# Altium schematic sheet ADC.SchDoc
size OrCAD E; SheetNumber: 1; SheetTotal: 1
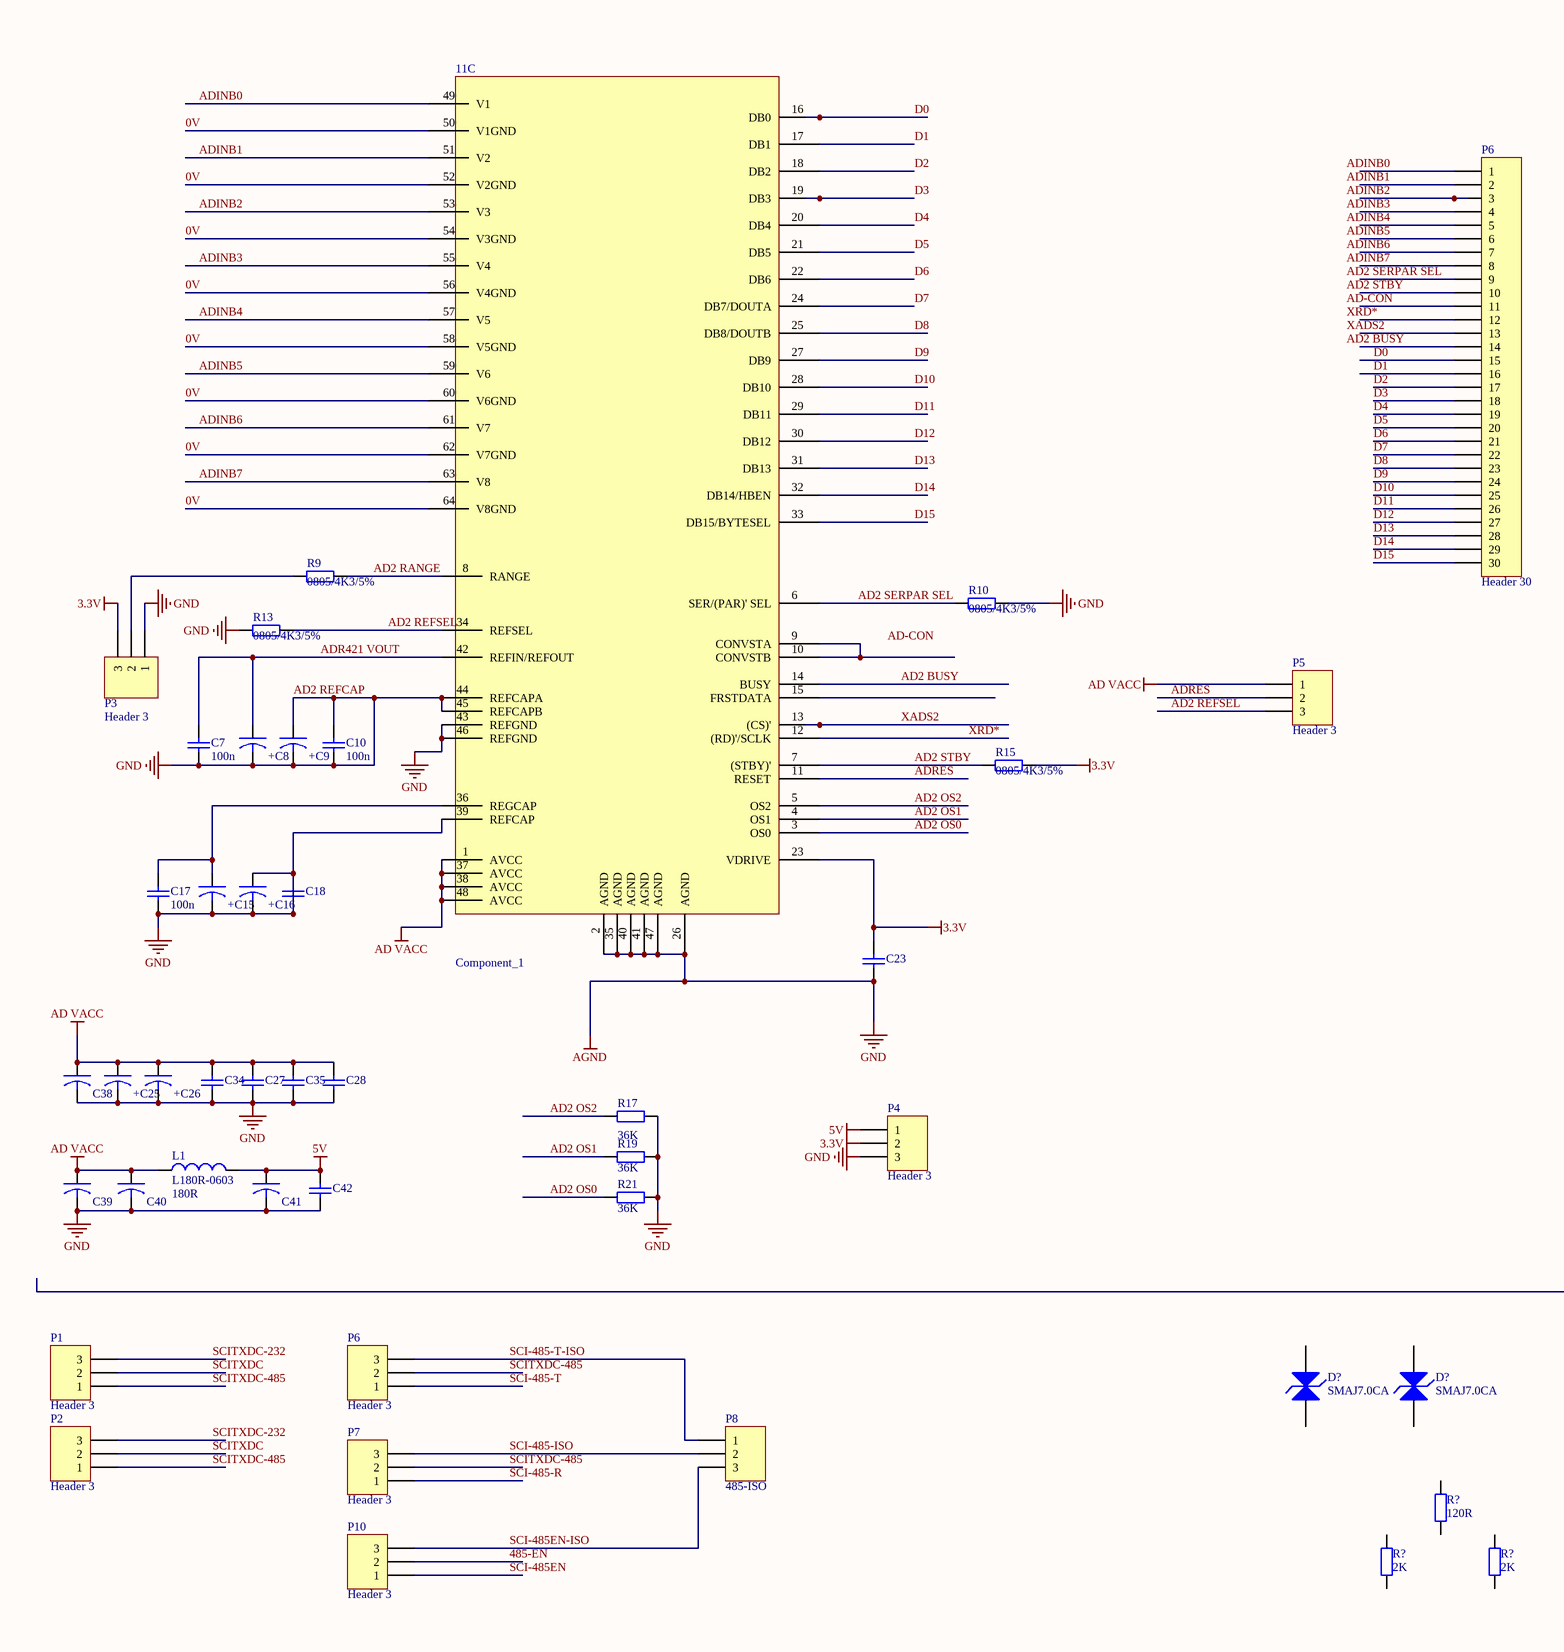
[diagram p0: ADC.SchDoc, left]
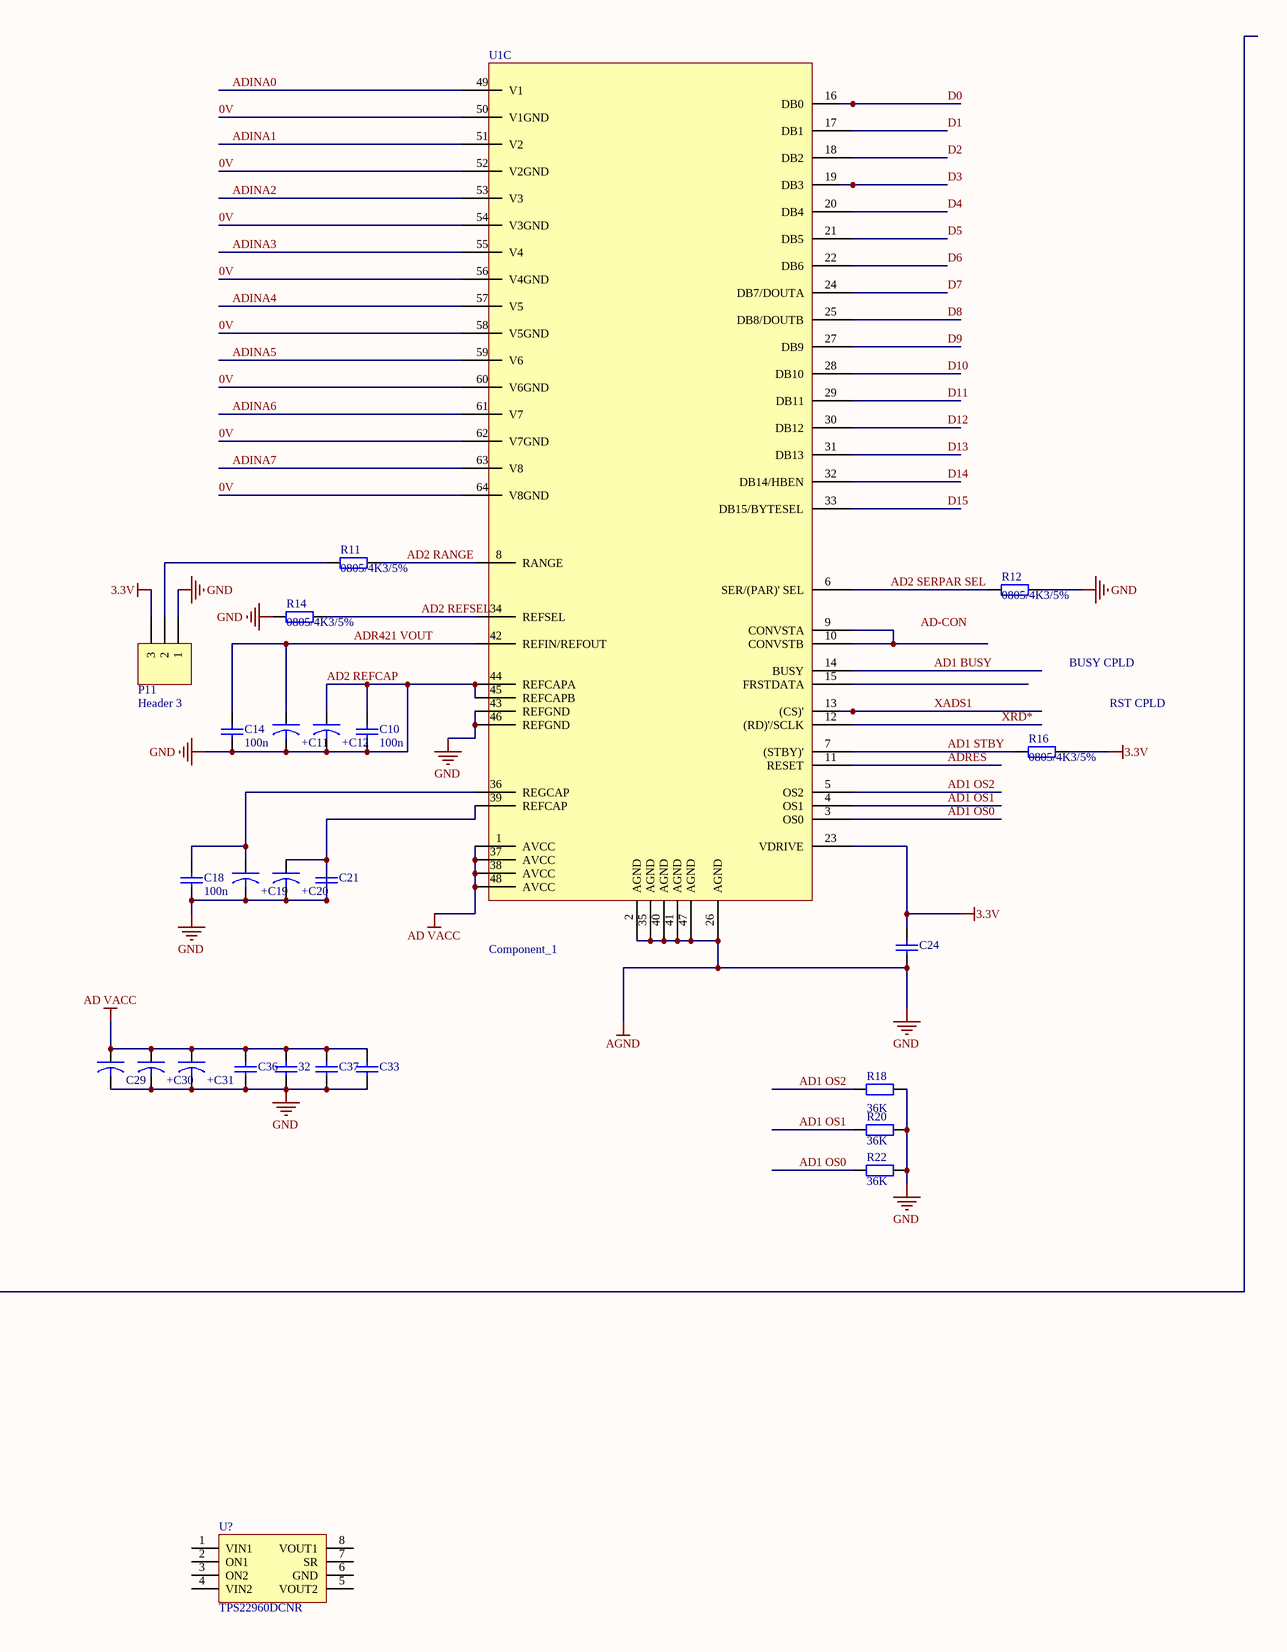
[diagram p1: ADC.SchDoc, right]

## Parts
(Parts that share a designator on the sheet are numbered #1, #2 ... from top to bottom, then left to right.)
11  Component_1  [LQFP-64_L10.0-W10.0-P0.50-LS12.0-BL]  (part C of 3)
32  C100n-1206  [C0805]  (value not drawn)
+C8  CD10u/25V-B(3528)  [C1206]  (value not drawn)
+C9  CD10u/25V-B(3528)  [C0805]  (value not drawn)
+C11  CD10u/25V-B(3528)  [C1206]  (value not drawn)
+C12  CD10u/25V-B(3528)  [C0805]  (value not drawn)
+C15  CD10u/25V-B(3528)  [C0805]  (value not drawn)
+C16  CD10u/25V-B(3528)  [C0805]  (value not drawn)
+C19  CD10u/25V-B(3528)  [C0805]  (value not drawn)
+C20  CD10u/25V-B(3528)  [C0805]  (value not drawn)
+C25  CD10u/25V-B(3528)  [C0805]  (value not drawn)
+C26  CD10u/25V-B(3528)  [C0805]  (value not drawn)
+C30  CD10u/25V-B(3528)  [C0805]  (value not drawn)
+C31  CD10u/25V-B(3528)  [C0805]  (value not drawn)
C7  value 100n  [C0805]  (hidden comment: C100n-1206)
C10#1  value 100n  [C0805]  (hidden comment: C100n-1206)
C10#2  value 100n  [C0805]  (hidden comment: C100n-1206)
C14  value 100n  [C0805]  (hidden comment: C100n-1206)
C17  value 100n  [C0805]  (hidden comment: C100n-1206)
C18#1  value 100n  [C0805]  (hidden comment: C100n-1206)
C18#2  C100n-1206  [C0805]  (value not drawn)
C21  C100n-1206  [C0805]  (value not drawn)
C23  C100n-1206  [C0805]  (value not drawn)
C24  C100n-1206  [C0805]  (value not drawn)
C27  C100n-1206  [C0805]  (value not drawn)
C28  C100n-1206  [C0805]  (value not drawn)
C29  CD10u/25V-B(3528)  [C0805]  (value not drawn)
C33  C100n-1206  [C0805]  (value not drawn)
C34  C100n-1206  [C0805]  (value not drawn)
C35  C100n-1206  [C0805]  (value not drawn)
C36  C100n-1206  [C0805]  (value not drawn)
C37  C100n-1206  [C0805]  (value not drawn)
C38  CD10u/25V-B(3528)  [C0805]  (value not drawn)
C39  CD10u/25V-B(3528)  [C0805]  (value not drawn)
C40  CD10u/25V-B(3528)  [C0805]  (value not drawn)
C41  CD10u/25V-B(3528)  [C0805]  (value not drawn)
C42  C100n-1206  [C0805]  (value not drawn)
D?#1  SMAJ7.0CA  [DO-214AC(SMA)]
D?#2  SMAJ7.0CA  [DO-214AC(SMA)]
L1  L180R-0603  value 180R  [R38]
P1  Header 3  [HDR1X3]
P2  Header 3  [HDR1X3]
P3  Header 3  [HDR1X3]
P4  Header 3  [HDR1X3]
P5  Header 3  [HDR1X3]
P6#1  Header 30  [HDR1X30]
P6#2  Header 3  [HDR1X3]
P7  Header 3  [HDR1X3]
P8  485-ISO  [HDR1X3]
P10  Header 3  [HDR1X3]
P11  Header 3  [HDR1X3]
R9  value 0805/4K3/5%  [AXIAL-0.4]  (hidden comment: R300R-0805)
R10  value 0805/4K3/5%  [AXIAL-0.4]  (hidden comment: R300R-0805)
R11  value 0805/4K3/5%  [AXIAL-0.4]  (hidden comment: R300R-0805)
R12  value 0805/4K3/5%  [AXIAL-0.4]  (hidden comment: R300R-0805)
R13  value 0805/4K3/5%  [AXIAL-0.4]  (hidden comment: R300R-0805)
R14  value 0805/4K3/5%  [AXIAL-0.4]  (hidden comment: R300R-0805)
R15  value 0805/4K3/5%  [AXIAL-0.4]  (hidden comment: R300R-0805)
R16  value 0805/4K3/5%  [AXIAL-0.4]  (hidden comment: R300R-0805)
R17  value 36K  [AXIAL-0.4]  (hidden comment: R36K-0805)
R18  value 36K  [AXIAL-0.4]  (hidden comment: R36K-0805)
R19  value 36K  [AXIAL-0.4]  (hidden comment: R36K-0805)
R20  value 36K  [AXIAL-0.4]  (hidden comment: R36K-0805)
R21  value 36K  [AXIAL-0.4]  (hidden comment: R36K-0805)
R22  value 36K  [AXIAL-0.4]  (hidden comment: R36K-0805)
R?#1  value 120R  [R1206L]  (hidden comment: R120R-1206)
R?#2  value 2K  [R0805L]  (hidden comment: R2K-0805)
R?#3  value 2K  [R0805L]  (hidden comment: R2K-0805)
U1  Component_1  [LQFP-64_L10.0-W10.0-P0.50-LS12.0-BL]  (part C of 3)
U?  TPS22960DCNR  [SOT23-8]

## Nets
3.3V: 11.23(VDRIVE) C23.2 C24.2 P3.3 P4.2 P11.3 R15.1 R16.1 U1.23(VDRIVE)
5V: C41.1 C42.2 L1.2 P4.1
AD2 REFCAP: 11.2(AGND) 11.26(AGND) 11.35(AGND) 11.39(REFCAP) 11.40(AGND) 11.41(AGND) 11.43(REFGND) 11.44(REFCAPA) 11.45(REFCAPB) 11.46(REFGND) 11.47(AGND) 32.1 +C8.2 +C9.1 +C9.2 +C11.2 +C12.1 +C12.2 +C15.2 +C16.1 +C16.2 +C19.2 +C20.1 +C20.2 +C25.2 +C26.2 +C30.2 +C31.2 C7.1 C10#1.1 C10#1.2 C10#2.1 C10#2.2 C14.1 C17.1 C18#1.1 C18#2.1 C18#2.2 C21.1 C21.2 C23.1 C24.1 C27.1 C28.1 C29.2 C33.1 C34.1 C35.1 C36.1 C37.1 C38.2 C39.2 C40.2 C41.2 C42.1 P3.1 P4.3 P11.1 R10.1 R12.1 R13.2 R14.2 R17.2 R18.2 R19.2 R20.2 R21.2 R22.2 U1.2(AGND) U1.26(AGND) U1.35(AGND) U1.39(REFCAP) U1.40(AGND) U1.41(AGND) U1.43(REFGND) U1.44(REFCAPA) U1.45(REFCAPB) U1.46(REFGND) U1.47(AGND)  [also labelled AGND, GND]
AD VACC: 11.1(AVCC) 11.37(AVCC) 11.38(AVCC) 11.48(AVCC) 32.2 +C25.1 +C26.1 +C30.1 +C31.1 C27.2 C28.2 C29.1 C33.2 C34.2 C35.2 C36.2 C37.2 C38.1 C39.1 C40.1 L1.1 P5.1 U1.1(AVCC) U1.37(AVCC) U1.38(AVCC) U1.48(AVCC)
0V: 11.50(V1GND) 11.52(V2GND) 11.54(V3GND) 11.56(V4GND) 11.58(V5GND) 11.60(V6GND) 11.62(V7GND) 11.64(V8GND) U1.50(V1GND) U1.52(V2GND) U1.54(V3GND) U1.56(V4GND) U1.58(V5GND) U1.60(V6GND) U1.62(V7GND) U1.64(V8GND)
485-EN: P10.2
AD1 BUSY: U1.14(BUSY)
AD1 OS0: R22.1 U1.3(OS0)
AD1 OS1: R20.1 U1.4(OS1)
AD1 OS2: R18.1 U1.5(OS2)
AD1 STBY: R16.2 U1.7((STBY)')
AD2 BUSY: 11.14(BUSY)
AD2 OS0: 11.3(OS0) R21.1
AD2 OS1: 11.4(OS1) R19.1
AD2 OS2: 11.5(OS2) R17.1
AD2 RANGE: 11.8(RANGE) R9.1 R11.1 U1.8(RANGE)
AD2 REFSEL: 11.34(REFSEL) P5.3 R13.1 R14.1 U1.34(REFSEL)
AD2 SERPAR SEL: 11.6(SER/(PAR)'_SEL) R10.2 R12.2 U1.6(SER/(PAR)'_SEL)
AD2 STBY: 11.7((STBY)') R15.2
ADINA0: U1.49(V1)
ADINA1: U1.51(V2)
ADINA2: U1.53(V3)
ADINA3: U1.55(V4)
ADINA4: U1.57(V5)
ADINA5: U1.59(V6)
ADINA6: U1.61(V7)
ADINA7: U1.63(V8)
ADINB0: 11.49(V1)
ADINB1: 11.51(V2)
ADINB2: 11.53(V3)
ADINB3: 11.55(V4)
ADINB4: 11.57(V5)
ADINB5: 11.59(V6)
ADINB6: 11.61(V7)
ADINB7: 11.63(V8)
ADR421 VOUT: 11.42(REFIN/REFOUT) +C8.1 +C11.1 C7.2 C14.2 U1.42(REFIN/REFOUT)
ADRES: 11.11(RESET) P5.2 U1.11(RESET)
D0: 11.16(DB0) P6#1.15 U1.16(DB0)
D1: 11.17(DB1) P6#1.16 U1.17(DB1)
D2: 11.18(DB2) P6#1.17 U1.18(DB2)
D3: 11.19(DB3) P6#1.18 U1.19(DB3)
D4: 11.20(DB4) P6#1.19 U1.20(DB4)
D5: 11.21(DB5) P6#1.20 U1.21(DB5)
D6: 11.22(DB6) P6#1.21 U1.22(DB6)
D7: 11.24(DB7/DOUTA) P6#1.22 U1.24(DB7/DOUTA)
D8: 11.25(DB8/DOUTB) P6#1.23 U1.25(DB8/DOUTB)
D9: 11.27(DB9) P6#1.24 U1.27(DB9)
D10: 11.28(DB10) P6#1.25 U1.28(DB10)
D11: 11.29(DB11) P6#1.26 U1.29(DB11)
D12: 11.30(DB12) P6#1.27 U1.30(DB12)
D13: 11.31(DB13) P6#1.28 U1.31(DB13)
D14: 11.32(DB14/HBEN) P6#1.29 U1.32(DB14/HBEN)
D15: 11.33(DB15/BYTESEL) P6#1.30 U1.33(DB15/BYTESEL)
SCI-485-ISO: P7.3 P8.2
SCI-485-R: P7.1
SCI-485-T: P6#2.1
SCI-485-T-ISO: P6#2.3 P8.1
SCI-485EN: P10.1
SCI-485EN-ISO: P8.3 P10.3
SCITXDC: P1.2 P2.2
SCITXDC-232: P1.3 P2.3
SCITXDC-485: P1.1 P2.1 P6#2.2 P7.2
XADS1: U1.13((CS)')
XADS2: 11.13((CS)')
XRD*: 11.12((RD)'/SCLK) U1.12((RD)'/SCLK)
Net11_9: 11.9(CONVSTA) 11.10(CONVSTB)
Net11_36: 11.36(REGCAP) +C15.1 C17.2
Net+C19_1: +C19.1 C18#1.2 U1.36(REGCAP)
NetP3_2: P3.2 R9.2
NetP11_2: P11.2 R11.2
NetU1_9: U1.9(CONVSTA) U1.10(CONVSTB)

Not connected (* = marked no-connect by the designer): 11 15(FRSTDATA); D?#1 1(A) 2(K); D?#2 1(A) 2(K); P6#1 1 2 3 4 5 6 7 8 9 10 11 12 13 14; R?#1 1 2; R?#2 1 2; R?#3 1 2; U1 15(FRSTDATA); U? 1(VIN1) 2(ON1) 3(ON2) 4(VIN2) 5(VOUT2) 6(GND) 7(SR) 8(VOUT1)

## Notes on the sheet
- BUSY CPLD
- RST CPLD
- Labels drawn without touching a wire or pin: AD2 BUSY, AD2 SERPAR SEL, AD2 STBY, AD-CON, ADINB0, ADINB1, ADINB2, ADINB4, ADINB6, XADS2, XRD*

## Library data of the parts
32 C7 C10#1 C10#2 C14 C17 C18#1 C18#2 C21 C23 C24 C27 C28 C33-C37 C42 = C100n-1206: Pb-free,1206L,100nF,NPO,±10%,50V,-55℃～125℃,N（三层电镀端头）,带装; Part Number: 3DZ0040032; specification: Pb-free,1206L,100nF,NPO,±10%,50V,-55℃～125℃,N（三层电镀端头）,带装
+C8 +C9 +C11 +C12 +C15 +C16 +C19 +C20 +C25 +C26 +C30 +C31 C29 C38-C41 = CD10u/25V-B(3528): Pb-free,贴片钽电容,10uF,±10%,25V,SMD,B型(3528),-25～+85℃,带装; Part Number: 3DZ0040212; specification: Pb-free,贴片钽电容,10uF,±10%,25V,SMD,B型(3528),-25～+85℃,带装; Value: 10u/25V
D?#1 D?#2 = SMAJ7.0CA: Pb-free,贴片瞬态抑制二极管,SMAJ7.0CA,Vrm=7.0V,Vbr=7.78～8.60V,Ppk=400W,Ifsm=40A,SMA(DO-214AC),-55～150℃; Part Number: 3DZ0060108; Specification: Pb-free,贴片瞬态抑制二极管,SMAJ7.0CA,Vrm=7.0V,Vbr=7.78～8.60V,Ppk=400W,Ifsm=40A,SMA(DO-214AC),-55～150℃; Value: SMAJ7.0CA
L1 = L180R-0603: Pb-free,片式磁珠,180Ω（@100MHz）,Rdc=0.45,IR=200mA,0603,±25%,; Part Number: 3DZ0052001; Specification: Pb-free,片式磁珠,180Ω（@100MHz）,Rdc=0.45,IR=200mA,0603,±25%,
P1-P5 P6#2 P7 P8 P10 P11 = Header 3: Header, 3-Pin; LatestRevisionDate: 17-Jul-2002; LatestRevisionNote: Re-released for DXP Platform.; Publisher: Altium Limited
P6#1 = Header 30: Header, 30-Pin; LatestRevisionDate: 17-Jul-2002; LatestRevisionNote: Re-released for DXP Platform.; Publisher: Altium Limited
R9-R16 = R300R-0805: Pb-free,0805,300Ω,1%,1/8W,±100PPM,100V,-55℃～155℃; Part Number: 3DZ0030046; specification: Pb-free,0805,300Ω,1%,1/8W,±100PPM,100V,-55℃～155℃
R17-R22 = R36K-0805: Pb-free,0805,36kΩ,1%,1/8W,±100PPM,100V,-55℃～155℃; Part Number: 3DZ0030050; specification: Pb-free,0805,36kΩ,1%,1/8W,±100PPM,100V,-55℃～155℃
R?#1 = R120R-1206: Pb-free,1206,120Ω,1%,1/4W,±100PPM,200V,-55℃～155℃; Part Number: 3DZ0030098; specification: Pb-free,1206,120Ω,1%,1/4W,±100PPM,200V,-55℃～155℃
R?#2 R?#3 = R2K-0805: Pb-free,0805,2kΩ,1%,1/8W,±100PPM,100V,-55℃～155℃; Part Number: 3DZ0030040; specification: Pb-free,0805,2kΩ,1%,1/8W,±100PPM,100V,-55℃～155℃
U? = TPS22960DCNR: Pb-free,低压差LDO,SN105125DBVR,150mA,SOT23-5,?40°C~+125°C,TI; Part Number: 3DZ0020084; Specification: Pb-free,低输入电压双路负载开关,TPS22960DCNR,Vin=-0.3~6V,Vout=Vin+0.3V,SOT23-8,?40°C~+85°C,TI; Value: TPS22960DCNR